# EAGLE schematic MagnetCoreMemory_Current (EAGLE 7.2.0)
CNAME: Magnet Core Memory driver; CREVISION: 1.0; DESIGNER: Simon de Bakker

## Sheet 1 of 2: Core driver
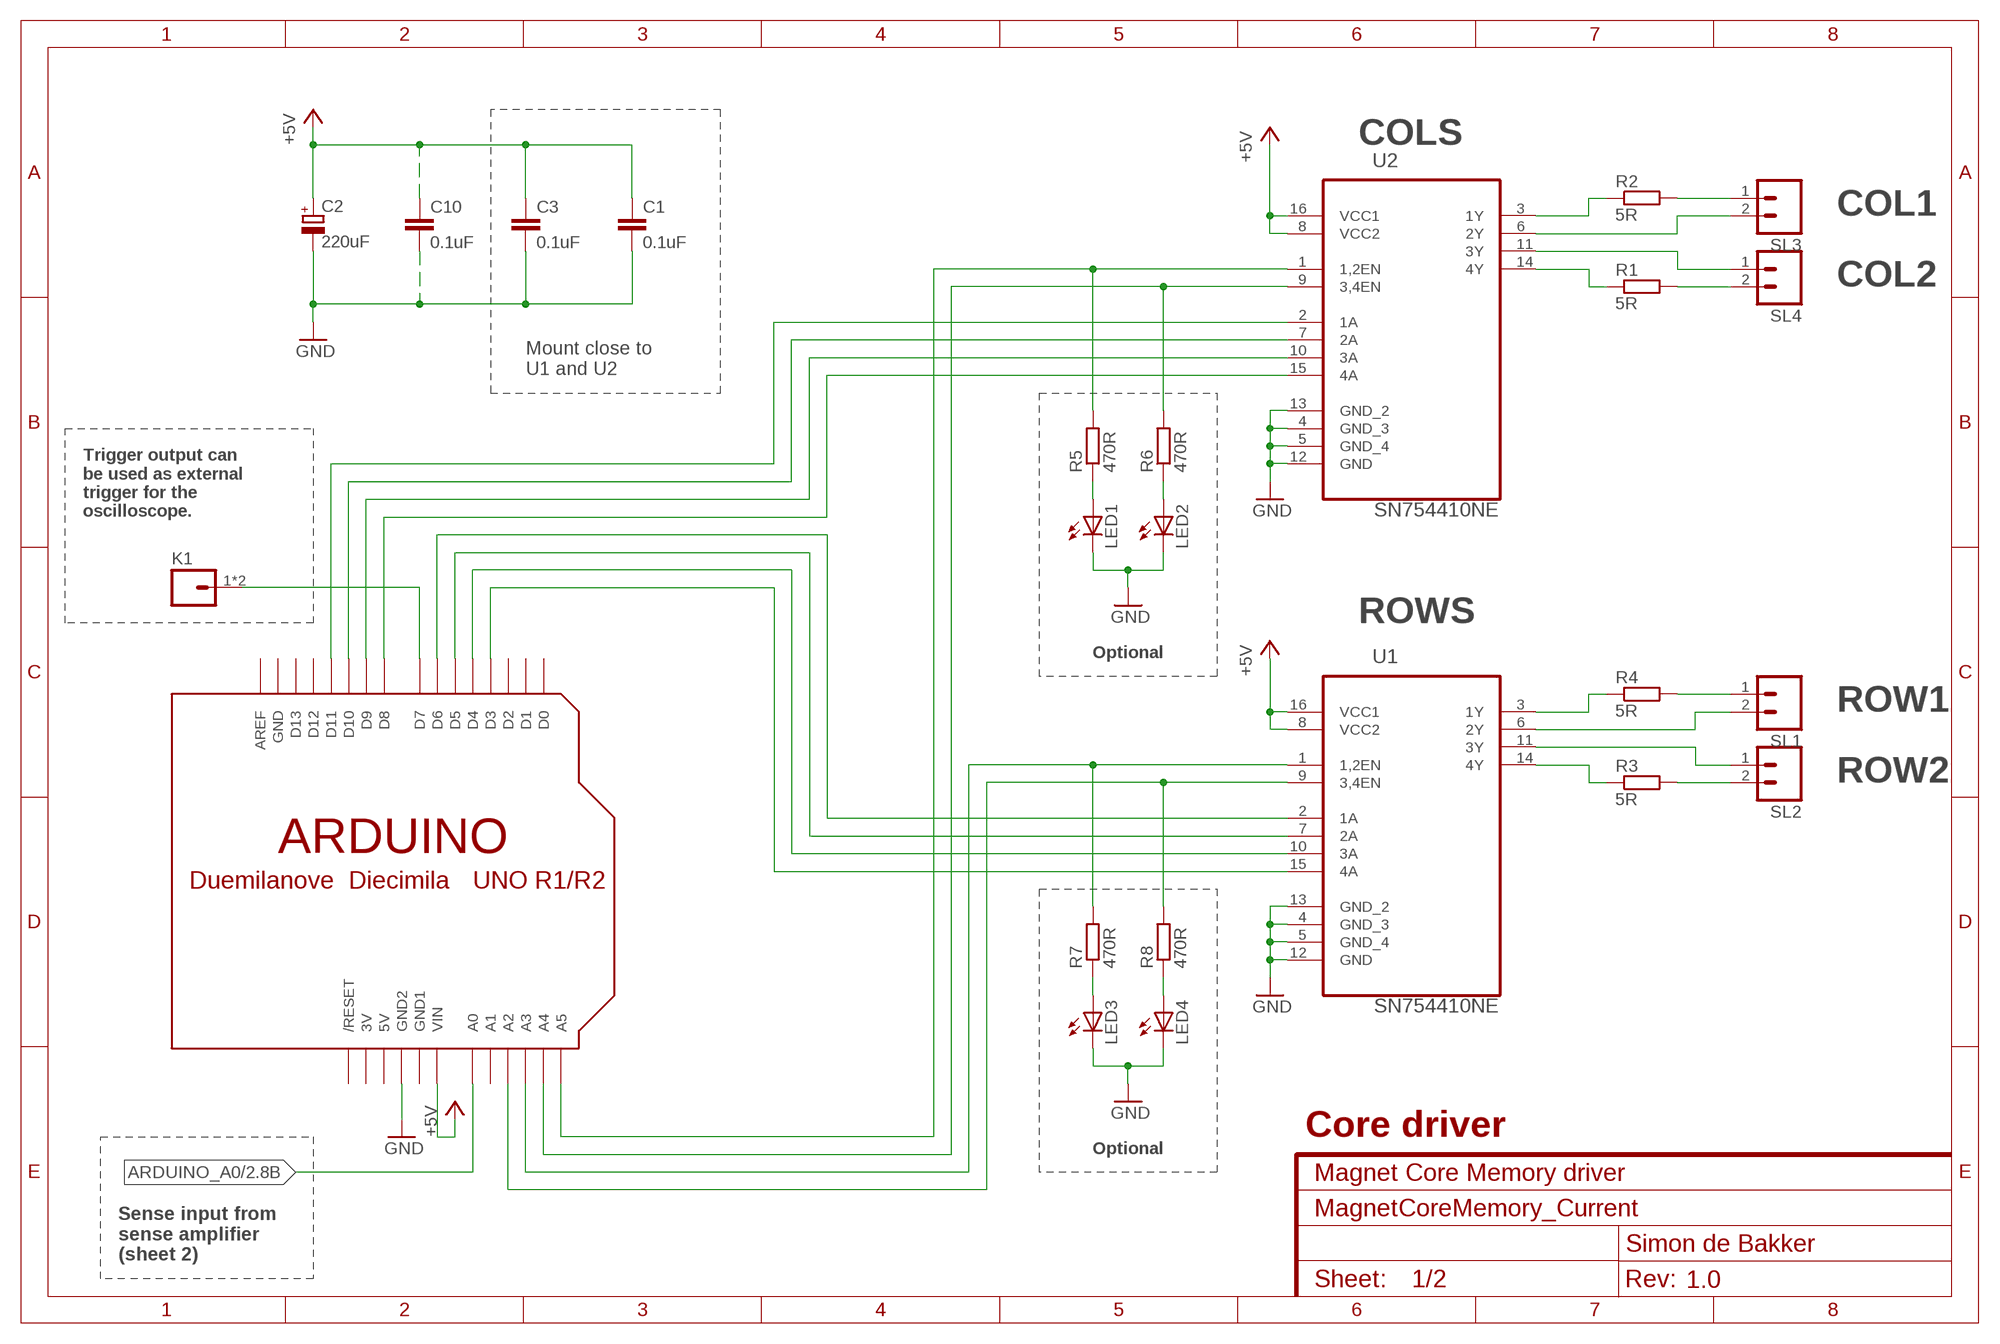
[diagram p0: schematic, sheet 1]

### Parts
C1  0.1uF  C-EU025-030X050  [C025-030X050]
C2  220uF  CPOL-EUE3.5-8  [E3,5-8]
C3  0.1uF  C-EU025-030X050  [C025-030X050]
C10  0.1uF  C-EU025-030X050  [C025-030X050]
K1  M01-MOLEX-104188-0110  [LITE-TRAP-CONNECTOR-1]
LED1  LED3MM  [LED3MM]
LED2  LED3MM  [LED3MM]
LED3  LED3MM  [LED3MM]
LED4  LED3MM  [LED3MM]
R1  5R  R-EU_0207/10  [0207/10]
R2  5R  R-EU_0207/10  [0207/10]
R3  5R  R-EU_0207/10  [0207/10]
R4  5R  R-EU_0207/10  [0207/10]
R5  470R  R-EU_0207/10  [0207/10]
R6  470R  R-EU_0207/10  [0207/10]
R7  470R  R-EU_0207/10  [0207/10]
R8  470R  R-EU_0207/10  [0207/10]
SL1  M02  [02P]
SL2  M02  [02P]
SL3  M02  [02P]
SL4  M02  [02P]
U1  SN754410NE  [DIP254P762X508-16]
U2  SN754410NE  [DIP254P762X508-16]
U$1  ARDUINOUNO  [ARDUINO]

### Nets
+5V: C1.1 C2.+ C3.1 C10.1 U1.8(VCC2) U1.16(VCC1) U2.8(VCC2) U2.16(VCC1) U$1.VIN ; also sheet 2
ARDUINO_A0: U$1.A0 ; also sheet 2
GND: C1.2 C2.- C3.2 C10.2 LED1.K(C) LED2.K(C) LED3.K(C) LED4.K(C) U1.4(GND_3) U1.5(GND_4) U1.12(GND) U1.13(GND_2) U2.4(GND_3) U2.5(GND_4) U2.12(GND) U2.13(GND_2) U$1.GND2 ; also sheet 2
N$2: U1.7(2A) U$1.D5
N$4: U2.15(4A) U$1.D8
N$6: U2.10(3A) U$1.D9
N$7: U2.7(2A) U$1.D10
N$9: R5.2 U2.1(1,2EN) U$1.A5
N$10: R6.2 U2.9(3,4EN) U$1.A4
N$11: R7.2 U1.1(1,2EN) U$1.A3
N$12: R8.2 U1.9(3,4EN) U$1.A2
N$13: R2.1 U2.3(1Y)
N$14: SL3.2 U2.6(2Y)
N$15: R2.2 SL3.1
N$16: R1.1 U2.14(4Y)
N$17: R1.2 SL4.2
N$18: SL4.1 U2.11(3Y)
N$19: R4.1 U1.3(1Y)
N$20: R3.1 U1.14(4Y)
N$21: SL2.1 U1.11(3Y)
N$22: SL1.2 U1.6(2Y)
N$23: R4.2 SL1.1
N$24: R3.2 SL2.2
N$25: U1.15(4A) U$1.D3
N$26: U1.10(3A) U$1.D4
N$27: U1.2(1A) U$1.D6
N$28: U2.2(1A) U$1.D11
N$31: LED1.A R5.1
N$32: LED2.A R6.1
N$33: LED3.A R7.1
N$34: LED4.A R8.1
TRIG: K1.1 K1.2 U$1.D7
Unconnected: U$1.A1 U$1.AREF U$1.D0 U$1.D1 U$1.D2 U$1.D12 U$1.D13 U$1.RESET(/RESET)

### Notes on the sheet
- COLS
- COL1
- COL2
- Mount close to 
  U1 and U2
- Trigger output can
  be used as external
  trigger for the
  oscilloscope.
- ROWS
- Optional
- ROW1
- ROW2
- Core driver
- Optional
- Sense input from
  sense amplifier
  (sheet 2)

## Sheet 2 of 2: Sense amplifier
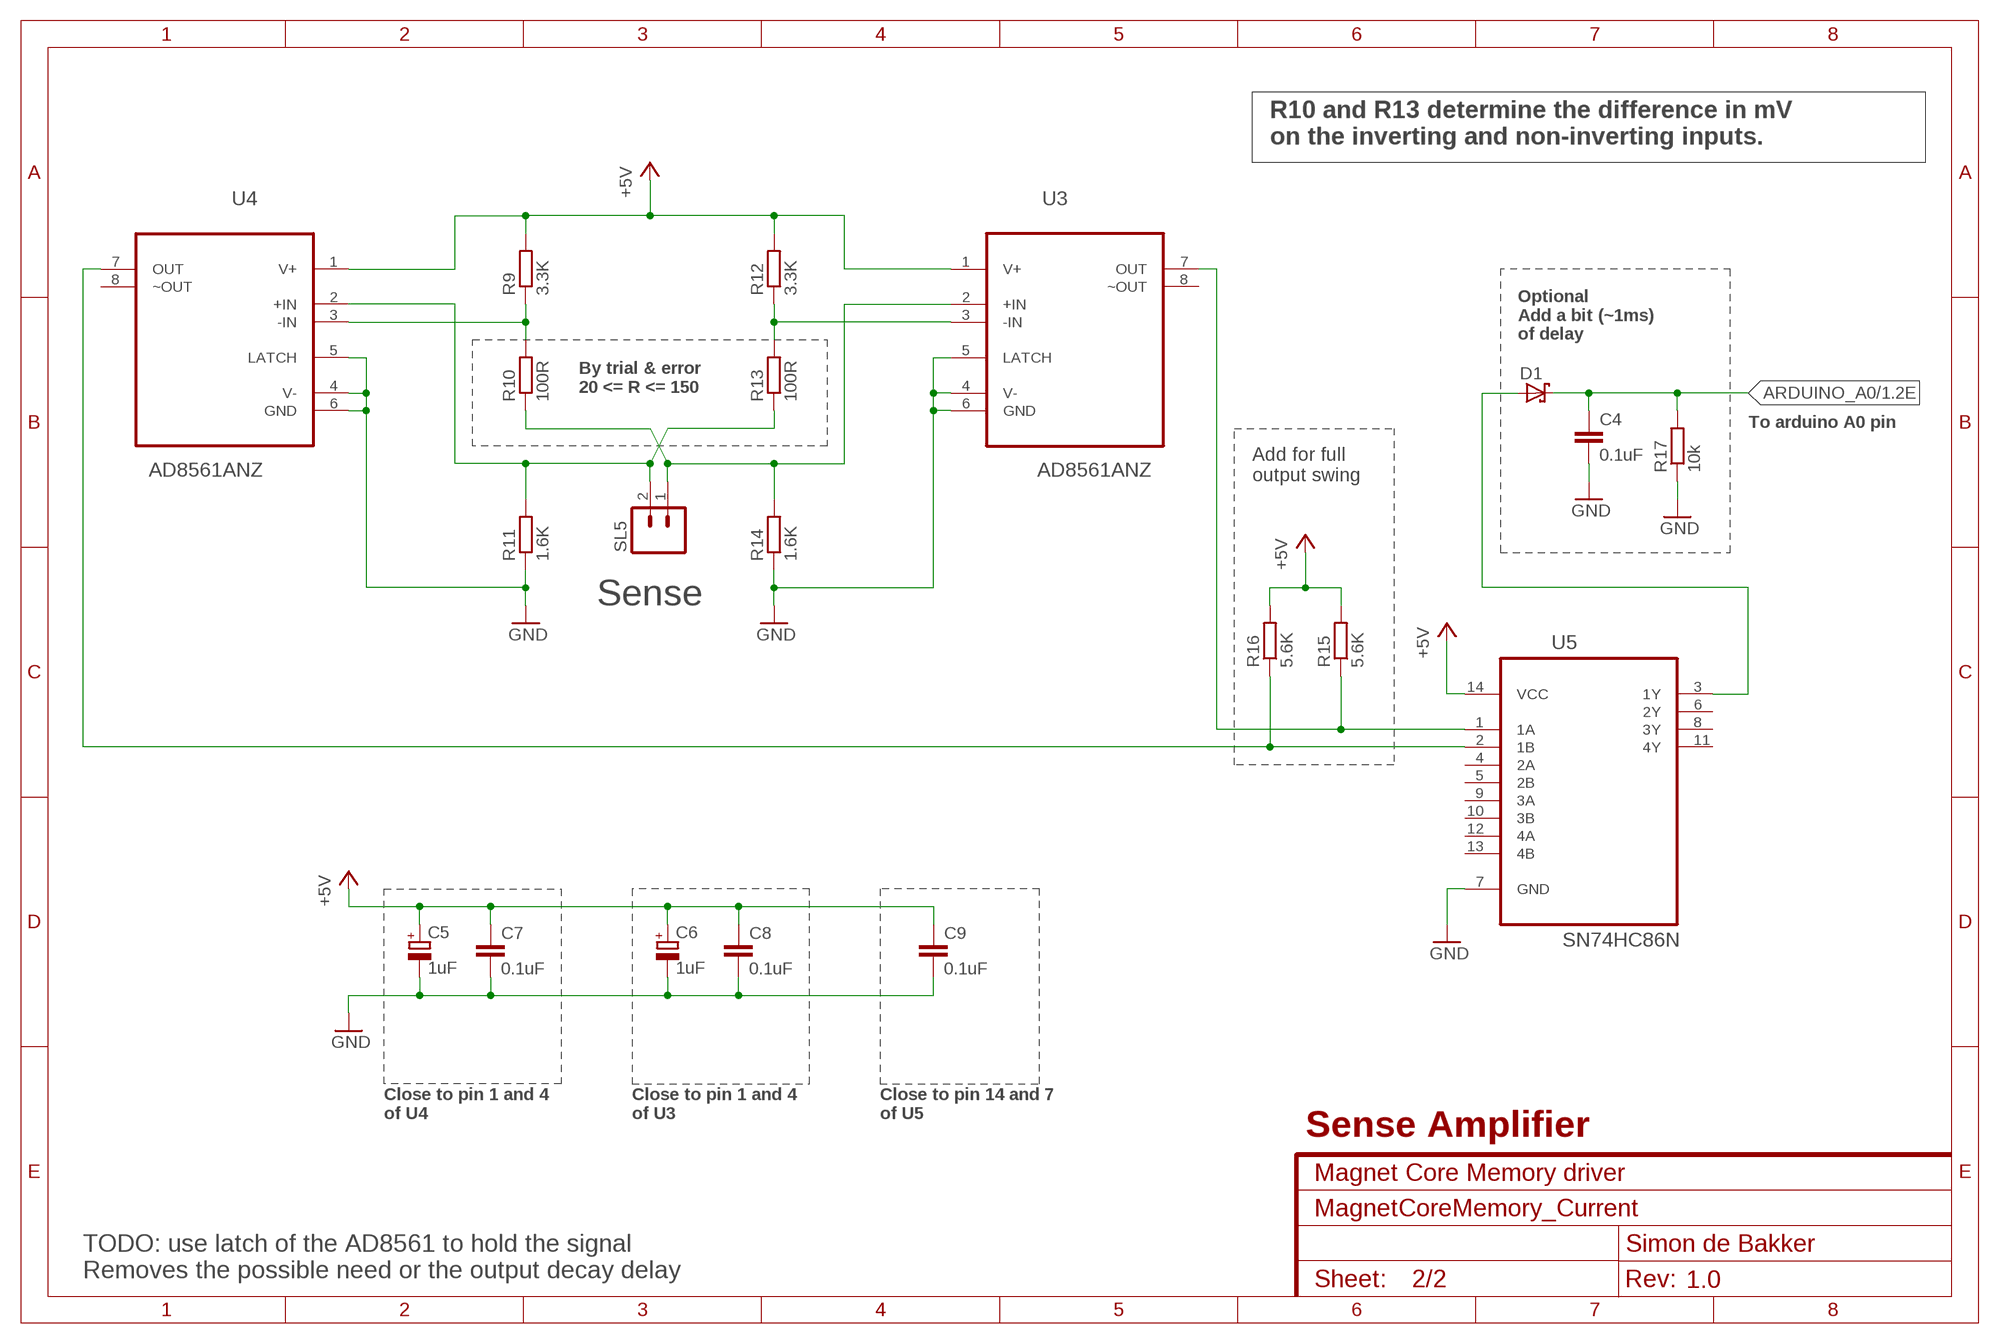
[diagram p1: schematic, sheet 2]

### Parts
C4  0.1uF  C-EU025-030X050  [C025-030X050]
C5  1uF  CPOL-EUE3.5-8  [E3,5-8]
C6  1uF  CPOL-EUE3.5-8  [E3,5-8]
C7  0.1uF  C-EU025-030X050  [C025-030X050]
C8  0.1uF  C-EU025-030X050  [C025-030X050]
C9  0.1uF  C-EU025-030X050  [C025-030X050]
D1  SCHOTTKY-DIODECB417-15  [CB417-15]
R9  3.3K  R-EU_0207/10  [0207/10]
R10  100R  R-EU_0207/10  [0207/10]
R11  1.6K  R-EU_0207/10  [0207/10]
R12  3.3K  R-EU_0207/10  [0207/10]
R13  100R  R-EU_0207/10  [0207/10]
R14  1.6K  R-EU_0207/10  [0207/10]
R15  5.6K  R-EU_0207/10  [0207/10]
R16  5.6K  R-EU_0207/10  [0207/10]
R17  10k  R-EU_0207/10  [0207/10]
SL5  M02  [02P]
U3  AD8561ANZ  [DIP254P762X533-8]
U4  AD8561ANZ  [DIP254P762X533-8]
U5  SN74HC86N  [DIP254P762X508-14]

### Nets
+5V: C5.+ C6.+ C7.1 C8.1 C9.1 R9.2 R12.2 R15.2 R16.2 U3.1(V+) U4.1(V+) U5.14(VCC) ; also sheet 1
ARDUINO_A0: C4.1 D1.C R17.2 ; also sheet 1
GND: C4.2 C5.- C6.- C7.2 C8.2 C9.2 R11.1 R14.1 R17.1 U3.4(V-) U3.5(LATCH) U3.6(GND) U4.4(V-) U4.5(LATCH) U4.6(GND) U5.7(GND) ; also sheet 1
N$5: D1.A U5.3(1Y)
N$29: R9.1 R10.2 U4.3(-IN)
N$30: R12.1 R13.2 U3.3(-IN)
N$35: R10.1 R14.2 SL5.1 U3.2(+IN)
N$36: R11.2 R13.1 SL5.2 U4.2(+IN)
N$37: R16.1 U4.7(OUT) U5.2(1B)
N$38: R15.1 U3.7(OUT) U5.1(1A)
Unconnected: U3.8(~OUT) U4.8(~OUT) U5.4(2A) U5.5(2B) U5.6(2Y) U5.8(3Y) U5.9(3A) U5.10(3B) U5.11(4Y) U5.12(4A) U5.13(4B)

### Notes on the sheet
- R10 and R13 determine the difference in mV 
  on the inverting and non-inverting inputs.
- Optional
  Add a bit (~1ms)
  of delay
- By trial & error
  20 <= R <= 150
- To arduino A0 pin
- Add for full 
  output swing
- Sense
- Close to pin 1 and 4
  of U4
- Close to pin 1 and 4
  of U3
- Close to pin 14 and 7
  of U5
- Sense Amplifier
- TODO: use latch of the AD8561 to hold the signal
  Removes the possible need or the output decay delay

## Power pins joined to a net without a drawn wire
3V: U$1.3V
5V: U$1.5V
GND: U$1.GND
GND1: U$1.GND1

## Library data of the parts
C1 C3 C4 C7-C10 = rcl:C-EU: CAPACITOR, European symbol
C2 C5 C6 = rcl:CPOL-EU: POLARIZED CAPACITOR, European symbol
D1 = diode:SCHOTTKY-DIODE: Schottky Diode
K1 = simbits:M01
LED1-LED4 = led:LED: LED OSRAM: - CHIPLED LG R971, LG N971, LY N971, LG Q971, LY Q971, LO R971, LY R971 LH N974, LH R974 LS Q976, LO Q976, LY Q976 LO Q996 - Hyper CHIPLED LW Q18S LB Q993, LB Q99A, LB R99A - SideLED LS A670, LO A670, LY A670, LG A670, LP A670 LB A673, LV A673, LT A673, LW A673 LH A674 LY A675 LS A676, LA A676, LO A676, LY A676, LW A676 LS A679, LY A679, LG A679 - Hyper Micro SIDELED® LS Y876, LA Y876, LO Y876, LY Y876 LT Y87S - SmartLED LW L88C, LW L88S LB L89C, LB L89S, LG L890 LS L89K, LO L89K, LY L89K LS L896, LA L896, LO L896, LY L896 - TOPLED LS T670, LO T670, LY T670, LG T670, LP T670 LSG T670, LSP T670, LSY T670, LOP T670, LYG T670 LG T671, LOG T671, LSG T671 LB T673, LV T673, LT T673, LW T673 LH T674 LS T676, LA T676, LO T676, LY T676, LB T676, LH T676, LSB T676, LW T676 LB T67C, LV T67C, LT T67C, LS T67K, LO T67K, LY T67K, LW E67C LS E67B, LA E67B, LO E67B, LY E67B, LB E67C, LV E67C, LT E67C LW T67C LS T679, LY T679, LG T679 LS T770, LO T770, LY T770, LG T770, LP T770 LB T773, LV T773, LT T773, LW T773 LH T774 LS E675, LA E675, LY E675, LS T675 LS T776, LA T776, LO T776, LY T776, LB T776 LHGB T686 LT T68C, LB T68C - Hyper Mini TOPLED® LB M676 - Mini TOPLED Santana® LG M470 LS M47K, LO M47K, LY M47K Source: http://www.osram.convergy.de LUXEON: - LUMILED® LXK2-PW12-R00, LXK2-PW12-S00, LXK2-PW14-U00, LXK2-PW14-V00 LXK2-PM12-R00, LXK2-PM12-S00, LXK2-PM14-U00 LXK2-PE12-Q00, LXK2-PE12-R00, LXK2-PE12-S00, LXK2-PE14-T00, LXK2-PE14-U00 LXK2-PB12-K00, LXK2-PB12-L00, LXK2-PB12-M00, LXK2-PB14-N00, LXK2-PB14-P00, LXK2-PB14-Q00 LXK2-PR12-L00, LXK2-PR12-M00, LXK2-PR14-Q00, LXK2-PR14-R00 LXK2-PD12-Q00, LXK2-PD12-R00, LXK2-PD12-S00 LXK2-PH12-R00, LXK2-PH12-S00 LXK2-PL12-P00, LXK2-PL12-Q00, LXK2-PL12-R00 Source: www.luxeon.com KINGBRIGHT: KA-3528ASYC Source: www.kingbright.com
R1-R17 = rcl:R-EU_: RESISTOR, European symbol
SL1-SL5 = con-amp-quick:M02: AMP QUICK CONNECTOR; OC_FARNELL: unknown; OC_NEWARK: unknown
U1 U2 = simbits:SN754410NE: QUADRUPLE HALF-H DRIVERS; MPN: SN754410NE; OC_FARNELL: 1470411; OC_NEWARK: 08F8145; PACKAGE: PDIP-16; SUPPLIER: Texas Instruments
U3 U4 = simbits:AD8561ANZ: Ultrafast 7 ns Single Supply Comparator; MPN: AD8561ANZ; OC_FARNELL: 9603867; OC_NEWARK: 59K6858; PACKAGE: PDIP-8; SUPPLIER: Analog Devices
U5 = simbits:SN74HC86N: QUADRUPLE 2-INPUT EXCLUSIVE-OR GATES; MPN: SN74HC86N; OC_FARNELL: 9591729; OC_NEWARK: 60K6846; PACKAGE: PDIP-14; SUPPLIER: Texas Instruments
U$1 = adafruit:ARDUINO: Arduino Diecimila/Duemilanove Make a shield with ease, this package has all the named pins as well as the two mounting drill holes and an outline of the USB and DC power connector. The outline is on the DIMENSION layer, so if your board house uses it they will cut the outline to match. http://www.ladyada.net/library/pcb/eaglelibrary.html